# EAGLE schematic B4L_power (EAGLE 9.5.2)
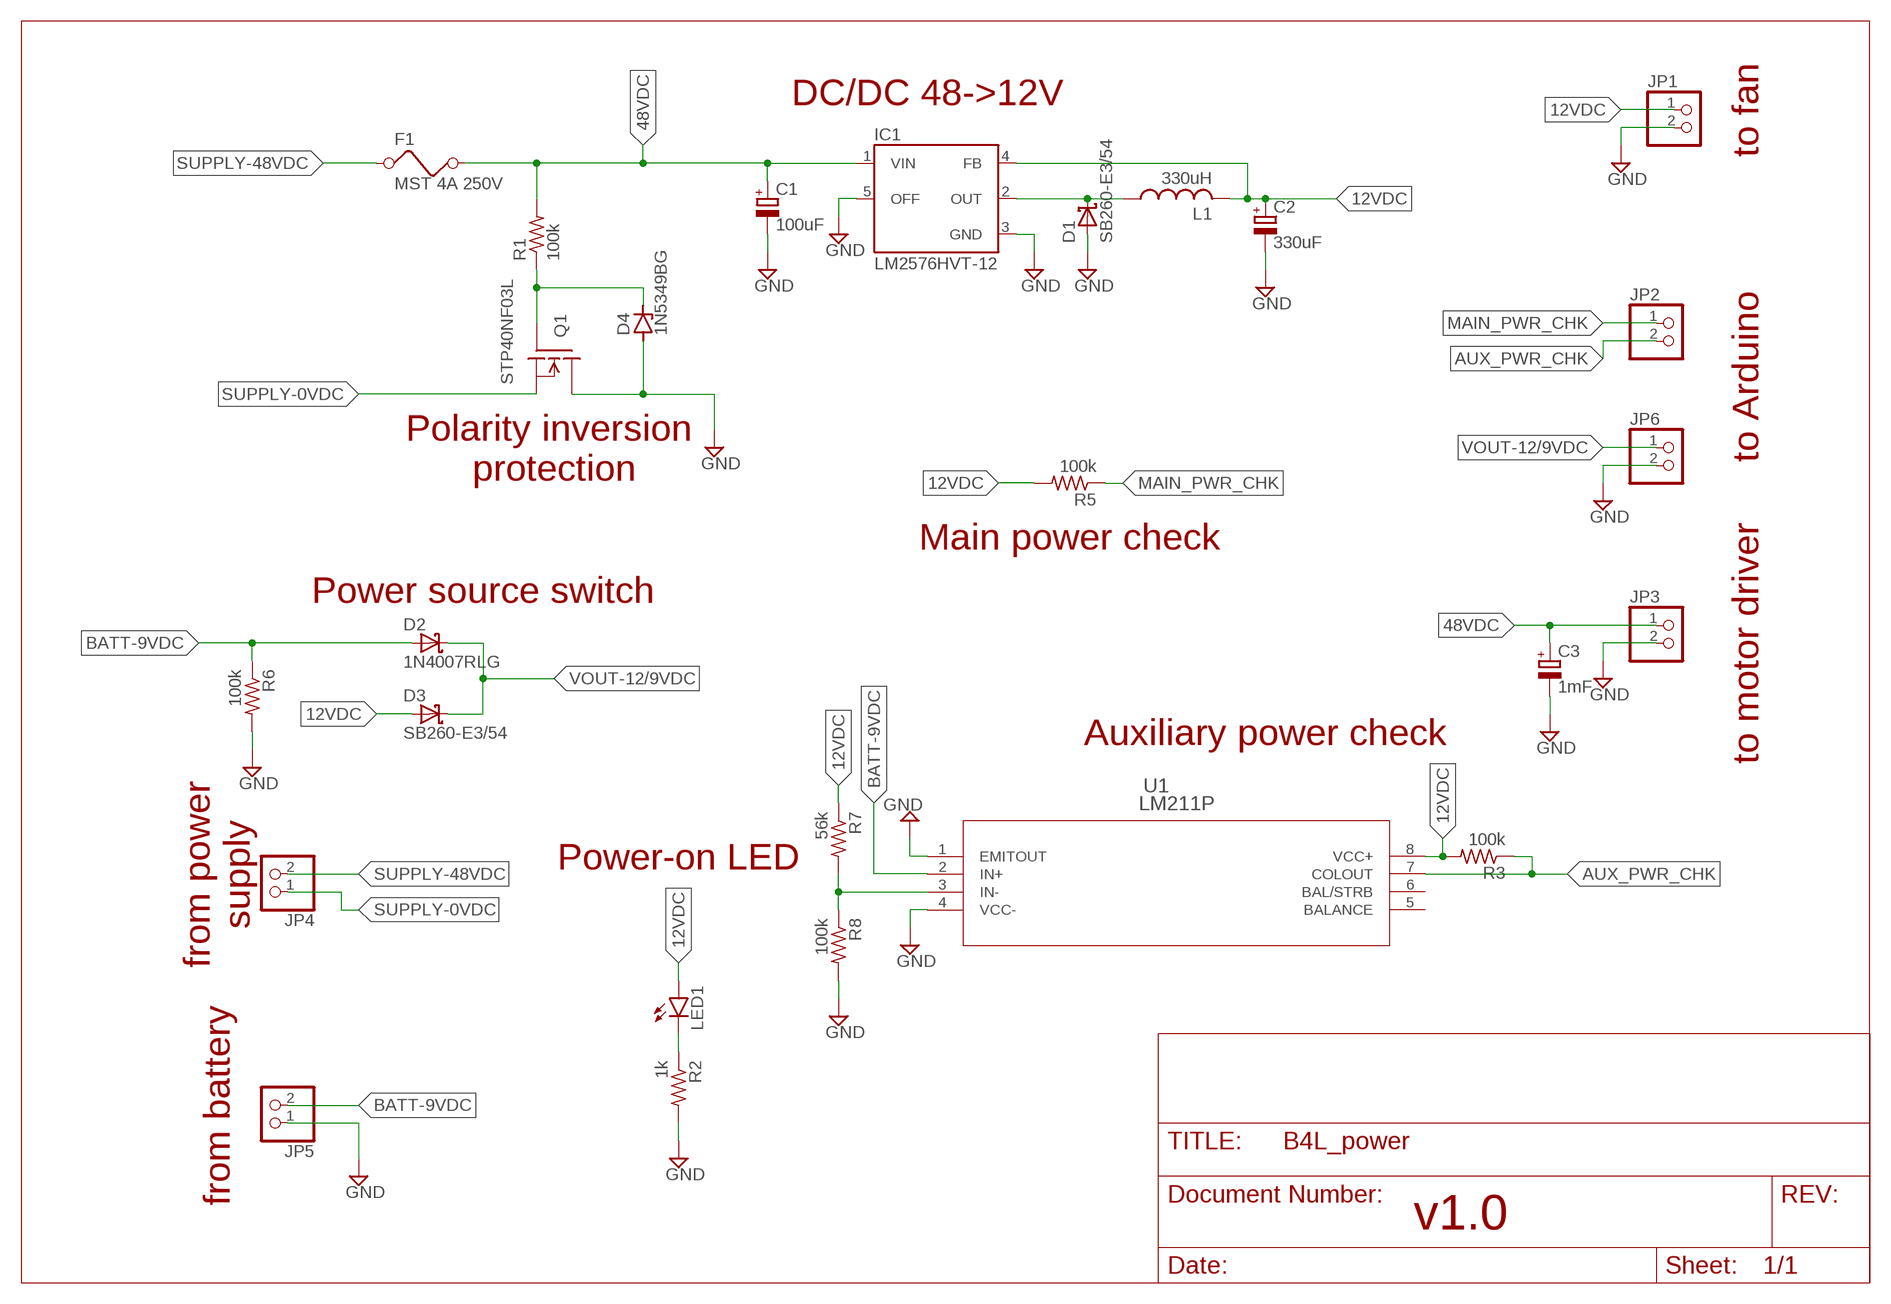
[diagram p0: schematic, sheet 1]

## Parts
C1  100uF  CPOL-EU140CLH-1010  [140CLH-1010]
C2  330uF  CPOL-EU140CLH-1010  [140CLH-1010]
C3  1mF  CPOL-EU140CLH-1010  [140CLH-1010]
D1  SB260-E3/54  1N5822  [DIOAD2120W130L950D530P]
D2  1N4007RLG  1N5822  [DIOAD2120W130L950D530P]
D3  SB260-E3/54  1N5822  [DIOAD2120W130L950D530P]
D4  1N5349BG  BZV10  [DO34Z7]
F1  MST 4A 250V  FUSE  [FUSE]
IC1  LM2576HVT-12  LM2576S  [TO263-5]
JP1  PINHD-1X2  [1X02]
JP2  PINHD-1X2  [1X02]
JP3  PINHD-1X2  [1X02]
JP4  PINHD-1X2  [1X02]
JP5  PINHD-1X2  [1X02]
JP6  PINHD-1X2  [1X02]
L1  330uH  L-USIRF-1  [IRF-1]
LED1  LED5MM  [LED5MM]
Q1  STP40NF03L  BUZ10  [TO220]
R1  100k  R-US_0309/10  [0309/10]
R2  1k  R-US_0309/10  [0309/10]
R3  100k  R-US_0309/10  [0309/10]
R5  100k  R-US_0309/10  [0309/10]
R6  100k  R-US_0309/10  [0309/10]
R7  56k  R-US_0309/10  [0309/10]
R8  100k  R-US_0309/10  [0309/10]
U1  LM211P  [P8]

## Nets
12VDC: C2.+ D3.A IC1.4(FB) JP1.1 L1.2 LED1.A R3.2 R5.2 R7.1 U1.8(VCC+)
48VDC: C1.+ C3.+ F1.2 IC1.1(VIN) JP3.1 R1.2
AUX_PWR_CHK: JP2.2 R3.1 U1.7(COLOUT)
BATT-9VDC: D2.A JP5.2 R6.1 U1.2(IN+)
GND: C1.- C2.- C3.- D1.A D4.A IC1.3(GND) IC1.5(OFF) JP1.2 JP3.2 JP5.1 JP6.2 Q1.2(D) R2.2 R6.2 R8.2 U1.1(EMITOUT) U1.4(VCC-)
MAIN_PWR_CHK: JP2.1 R5.1
N$1: D1.C IC1.2(OUT) L1.1
N$2: D4.C Q1.1(G) R1.1
N$3: LED1.K(C) R2.1
N$6: R7.2 R8.1 U1.3(IN-)
SUPPLY-0VDC: JP4.1 Q1.3(S)
SUPPLY-48VDC: F1.1 JP4.2
VOUT-12/9VDC: D2.C D3.C JP6.1
Unconnected: U1.5(BALANCE) U1.6(BAL/STRB)

## Notes on the sheet
- DC/DC 48->12V
- to fan
- to Arduino
- Polarity inversion 
  protection
- Main power check
- Power source switch
- to motor driver
- Auxiliary power check
- Power-on LED
- from power
  supply
- from battery
- v1.0

## Library data of the parts
C1-C3 = rcl:CPOL-EU: POLARIZED CAPACITOR, European symbol; SPICEPREFIX: C
D1-D3 = 1N5822:1N5822: 1N5822 Series 40 V 3 A Through Hole Schottky Rectifier - DO-201AD; AVAILABILITY: Unavailable; DESCRIPTION: R-SCHOTTKY 40V 3A; MF: ON Semiconductor; MP: 1N5822; PACKAGE: DO-201AD-201 Panjit; PRICE: None
D4 = diode:BZV10: Z DIODE
F1 = special:FUSE: FUSE 5 x 20 mm
IC1 = v-reg-3:LM2576: National Semiconductor <http://www.national.com> 3.0A "Simple Switcher"(c) 52kHz, Vout 1.23-37V (HV: 57V), Vin 40V (HV: 60V), 50µA standby current
JP1-JP6 = pinhead:PINHD-1X2: PIN HEADER
L1 = rcl:L-US: INDUCTOR, American symbol; SPICEPREFIX: L
LED1 = led:LED: LED OSRAM: - CHIPLED LG R971, LG N971, LY N971, LG Q971, LY Q971, LO R971, LY R971 LH N974, LH R974 LS Q976, LO Q976, LY Q976 LO Q996 - Hyper CHIPLED LW Q18S LB Q993, LB Q99A, LB R99A - SideLED LS A670, LO A670, LY A670, LG A670, LP A670 LB A673, LV A673, LT A673, LW A673 LH A674 LY A675 LS A676, LA A676, LO A676, LY A676, LW A676 LS A679, LY A679, LG A679 - Hyper Micro SIDELED® LS Y876, LA Y876, LO Y876, LY Y876 LT Y87S - SmartLED LW L88C, LW L88S LB L89C, LB L89S, LG L890 LS L89K, LO L89K, LY L89K LS L896, LA L896, LO L896, LY L896 - TOPLED LS T670, LO T670, LY T670, LG T670, LP T670 LSG T670, LSP T670, LSY T670, LOP T670, LYG T670 LG T671, LOG T671, LSG T671 LB T673, LV T673, LT T673, LW T673 LH T674 LS T676, LA T676, LO T676, LY T676, LB T676, LH T676, LSB T676, LW T676 LB T67C, LV T67C, LT T67C, LS T67K, LO T67K, LY T67K, LW E67C LS E67B, LA E67B, LO E67B, LY E67B, LB E67C, LV E67C, LT E67C LW T67C LS T679, LY T679, LG T679 LS T770, LO T770, LY T770, LG T770, LP T770 LB T773, LV T773, LT T773, LW T773 LH T774 LS E675, LA E675, LY E675, LS T675 LS T776, LA T776, LO T776, LY T776, LB T776 LHGB T686 LT T68C, LB T68C - Hyper Mini TOPLED® LB M676 - Mini TOPLED Santana® LG M470 LS M47K, LO M47K, LY M47K Source: http://www.osram.convergy.de LUXEON: - LUMILED® LXK2-PW12-R00, LXK2-PW12-S00, LXK2-PW14-U00, LXK2-PW14-V00 LXK2-PM12-R00, LXK2-PM12-S00, LXK2-PM14-U00 LXK2-PE12-Q00, LXK2-PE12-R00, LXK2-PE12-S00, LXK2-PE14-T00, LXK2-PE14-U00 LXK2-PB12-K00, LXK2-PB12-L00, LXK2-PB12-M00, LXK2-PB14-N00, LXK2-PB14-P00, LXK2-PB14-Q00 LXK2-PR12-L00, LXK2-PR12-M00, LXK2-PR14-Q00, LXK2-PR14-R00 LXK2-PD12-Q00, LXK2-PD12-R00, LXK2-PD12-S00 LXK2-PH12-R00, LXK2-PH12-S00 LXK2-PL12-P00, LXK2-PL12-Q00, LXK2-PL12-R00 Source: www.luxeon.com KINGBRIGHT: KA-3528ASYC Source: www.kingbright.com
Q1 = transistor-fet:BUZ10: N-Channel Enhancement MOSFET 50V; 20A; 0,080Ohm
R1-R3 R5-R8 = rcl:R-US_: RESISTOR, American symbol; SPICEPREFIX: R
U1 = custom:LM211P; DATASHEET_URL: http://www.ti.com/lit/gpn/LM211; DESCRIPTION: Differential Comparator With Strobes; FAMILY_NAME: COMPARATORS (SL); GENERIC_PART_NUMBER: LM211; INDUSTRY_STD_PKG_TYPE: PDIP; MANUFACTURER: Texas Instruments; PACKAGE_DESIGNATOR: P; PIN_COUNT: 8